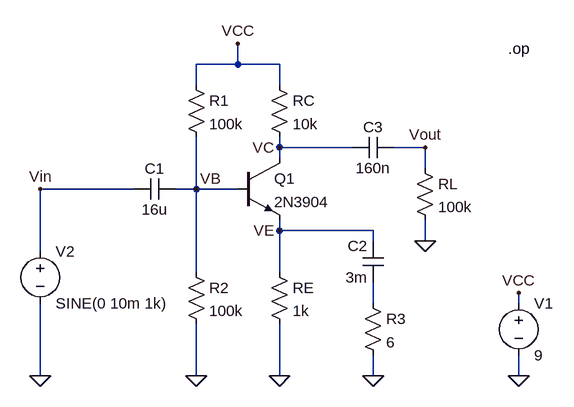
[diagram p0: schematic 2N3904_common_emitter.asc]
2N3904_common_emitter.asc, the LTspice schematic file:
Version 4
SHEET 1 956 680
WIRE 128 -32 128 -64
WIRE 128 -32 64 -32
WIRE 192 -32 128 -32
WIRE 64 0 64 -32
WIRE 192 0 192 -32
WIRE 192 96 192 80
WIRE 304 96 192 96
WIRE 416 96 368 96
WIRE 192 112 192 96
WIRE 416 128 416 96
WIRE -32 160 -176 160
WIRE 64 160 64 80
WIRE 64 160 32 160
WIRE 128 160 64 160
WIRE 192 224 192 208
WIRE 336 224 192 224
WIRE 336 240 336 224
WIRE 416 240 416 208
WIRE -176 256 -176 160
WIRE 64 288 64 160
WIRE 192 288 192 224
WIRE 336 336 336 304
WIRE 560 336 560 320
WIRE -176 448 -176 336
WIRE 64 448 64 368
WIRE 192 448 192 368
WIRE 336 448 336 416
WIRE 560 448 560 416
FLAG 64 448 0
FLAG 192 448 0
FLAG 336 448 0
FLAG 560 448 0
FLAG 560 320 VCC
FLAG 128 -64 VCC
FLAG -176 448 0
FLAG 64 160 VB
FLAG 192 96 VC
FLAG 192 224 VE
FLAG -176 160 Vin
FLAG 416 240 0
FLAG 416 96 Vout
SYMBOL npn 128 112 R0
SYMATTR InstName Q1
SYMATTR Value 2N3904
SYMBOL res 176 -16 R0
SYMATTR InstName RC
SYMATTR Value 10k
SYMBOL res 176 272 R0
SYMATTR InstName RE
SYMATTR Value 1k
SYMBOL res 48 -16 R0
SYMATTR InstName R1
SYMATTR Value 100k
SYMBOL res 48 272 R0
SYMATTR InstName R2
SYMATTR Value 100k
SYMBOL cap 32 144 R90
WINDOW 0 0 32 VBottom 2
WINDOW 3 32 32 VTop 2
SYMATTR InstName C1
SYMATTR Value 16u
SYMBOL cap 352 304 R180
WINDOW 0 24 56 Left 2
WINDOW 3 24 8 Left 2
SYMATTR InstName C2
SYMATTR Value 3m
SYMBOL cap 304 112 R270
WINDOW 0 32 32 VTop 2
WINDOW 3 0 32 VBottom 2
SYMATTR InstName C3
SYMATTR Value 160n
SYMBOL res 320 320 R0
SYMATTR InstName R3
SYMATTR Value 6
SYMBOL voltage 560 320 R0
WINDOW 123 0 0 Left 0
WINDOW 39 0 0 Left 0
SYMATTR InstName V1
SYMATTR Value 9
SYMBOL voltage -176 240 R0
WINDOW 123 0 0 Left 0
WINDOW 39 24 124 Left 2
SYMATTR InstName V2
SYMATTR Value SINE(0 10m 1k)
SYMBOL res 400 112 R0
SYMATTR InstName RL
SYMATTR Value 100k
TEXT 544 -56 Left 2 !.op

The netlist it stands for:
* 2N3904_common_emitter.asc
Q1 VC VB VE 0 2N3904
RC VCC VC 10k
RE VE 0 1k
R1 VCC VB 100k
R2 VB 0 100k
C1 VB Vin 16u
C2 N001 VE 3m
C3 VC Vout 160n
R3 N001 0 6
V1 VCC 0 9
V2 Vin 0 SINE(0 10m 1k)
RL Vout 0 100k
.model NPN NPN
.model PNP PNP
.lib standard.bjt
.op
.backanno
.end